# Altium schematic sheet Power.SchDoc
size A4; SheetNumber: 2; SheetTotal: 6
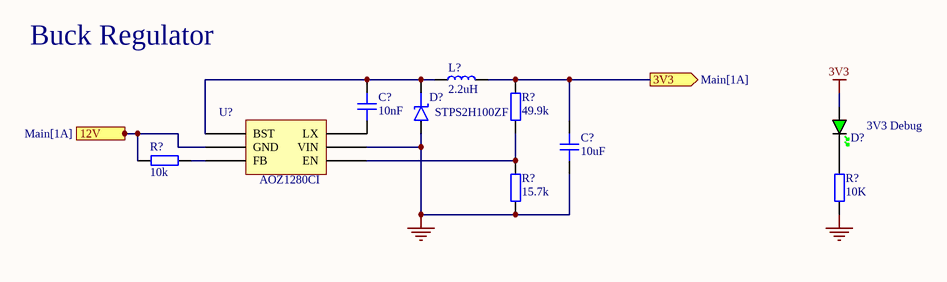
[diagram p0: Power.SchDoc]

## Parts
(Parts that share a designator on the sheet are numbered #1, #2 ... from top to bottom, then left to right.)
C?#1  10nF  [CAP_0402]
C?#2  10uF  [CAP_0402]
D?#1  STPS2H100ZF  [STPS2H100ZF]
D?#2  GREEN  [LED_0603_GREEN]  (value not drawn)
L?  2.2uH  [IND_2016]
R?#1  49.9k  [RES_0402]
R?#2  10k  [RES_0402]
R?#3  15.7k  [RES_0402]
R?#4  10K  [RES_0402]
U?  AOZ1280CI  [SOT95P280X125-6N]

## Ports
3V3 (out, see Main[1A]), 12V (in, see Main[1A])

## Nets
3V3: D?#2.A
GND: C?#2.2 D?#1.A R?#3.1 R?#4.1 U?.5(VIN)
3V3: C?#2.1 L?.2 R?#1.2 ; port 3V3  [a separate net that carries the same name]
12V: R?#2.1 U?.2(GND) ; port 12V
NetC?#1_1: C?#1.1 D?#1.K L?.1 U?.1(BST)
NetC?#1_2: C?#1.2 U?.6(LX)
NetD?#2_K: D?#2.K R?#4.2
NetR?#1_1: R?#1.1 R?#3.2 U?.4(EN)
NetR?#2_2: R?#2.2 U?.3(FB)

## Notes on the sheet
- Buck Regulator
- (near D?#2) 3V3 Debug

## Library data of the parts
C?#1 C?#2 = CAP_0402: Capacitor SMD 0402; Manufacturer: *; Manufacturer Part Number: *; Distributor Link: *; LCSC: *; Rating: *; Dielectric: *
D?#1 = D_SCHOTTKY_SOD_323: Diode Schottky SMD SOD-323
D?#2 = LED_0603_GREEN: LED 0603 GREEN SMD
L? = IND_1008: 2.2 µH Shielded Thin Film Inductor 2.5 A 87mOhm Max 0806 (2016 Metric); Supplier 1: Digikey; Supplier Part Number 1: 1276-6901-1-ND
R?#1-R?#4 = RES_0402: Resistor SMD 0402; Manufacturer: *; Manufacturer Part Number: *; Distributor Link: *; LCSC: *
U? = CMP-002-000004-2: Buck Switching Regulator IC Positive Adjustable 0.8V 1 Output 1.2A SOT-23-6